# EAGLE design MainBoard_V1 (EAGLE 9.6.2)
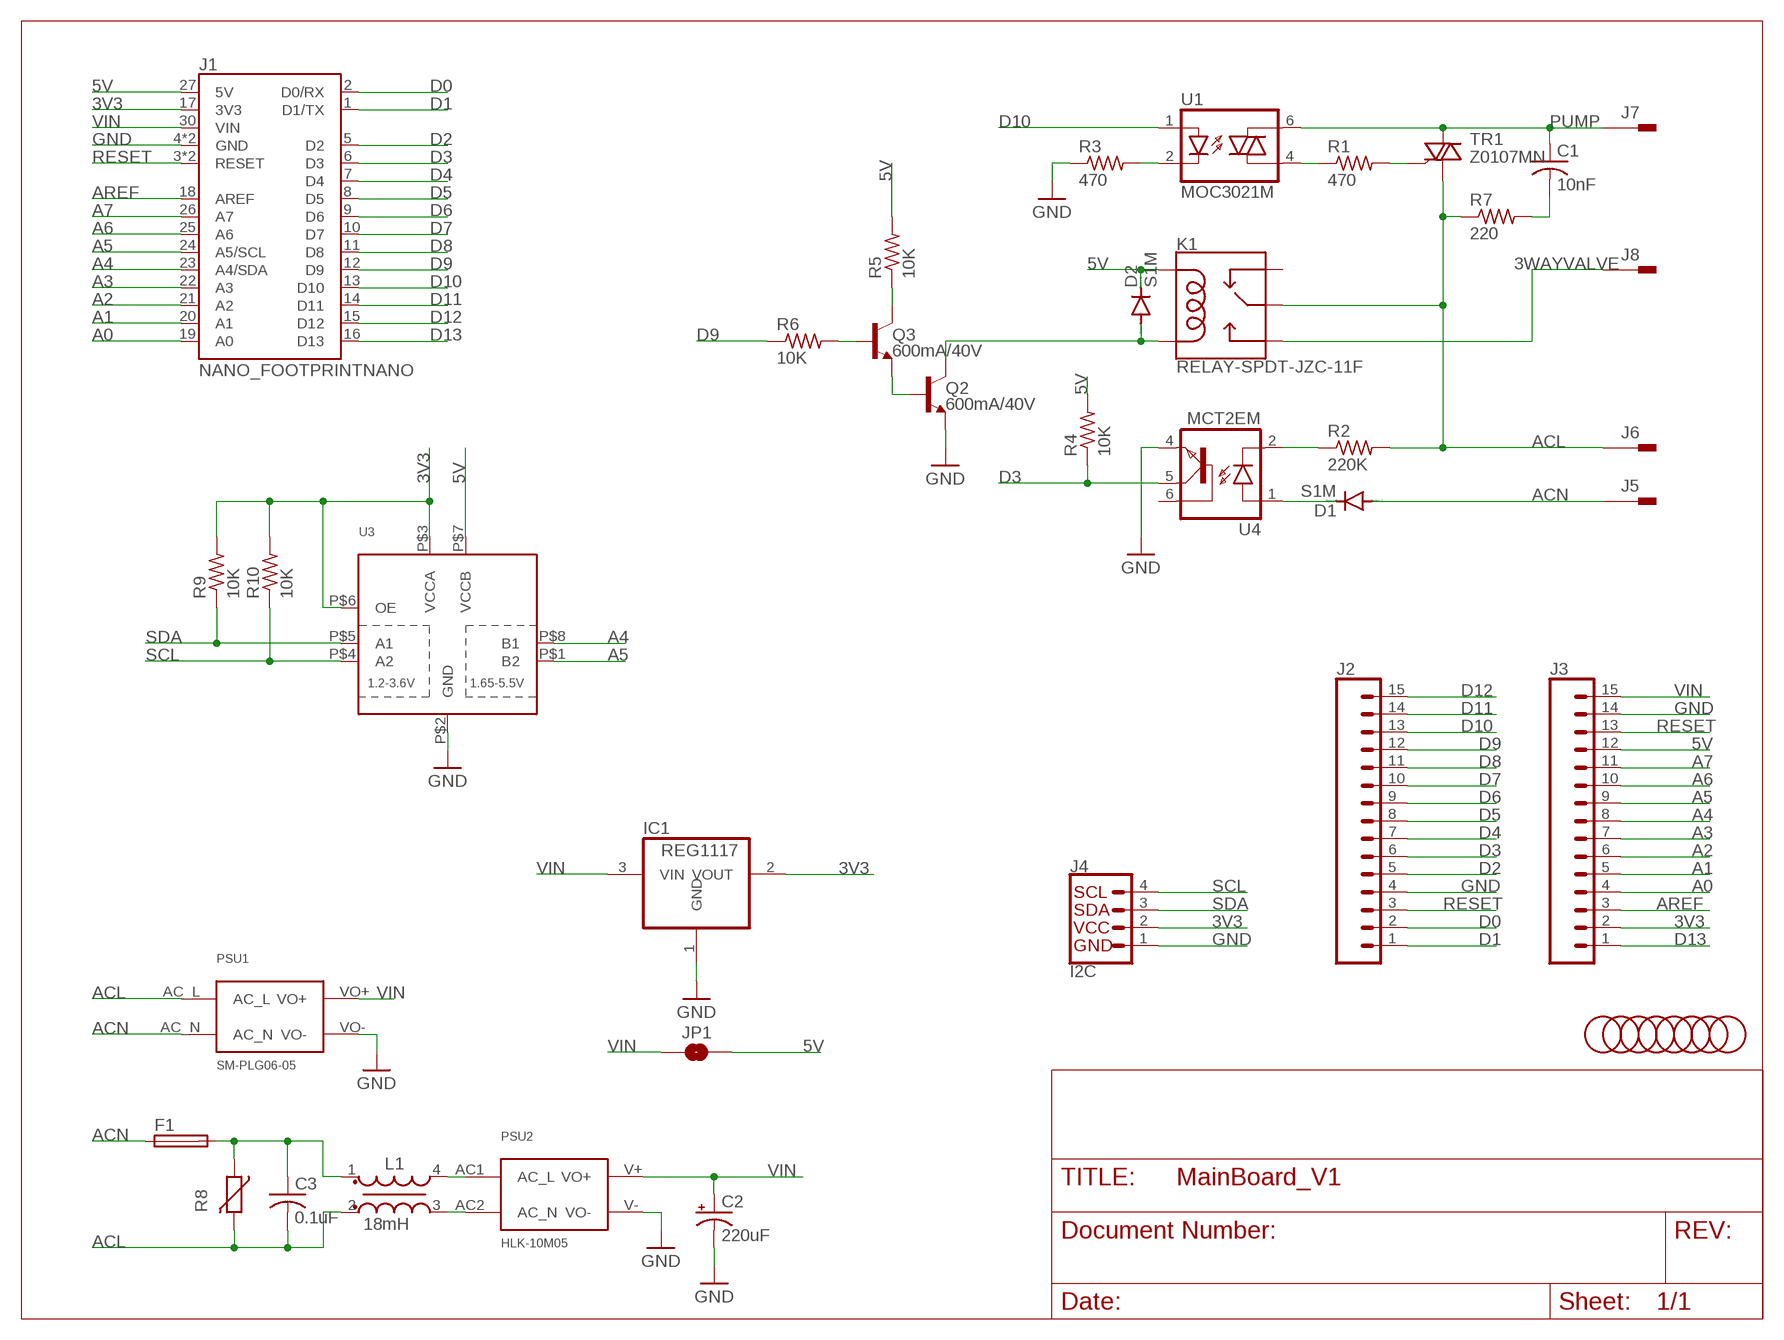
[diagram p0: schematic, sheet 1]

## Parts
C1  10nF  C-US075-032X103  [C075-032X103]
C2  220uF  CPOL-USE2.5-6  [E2,5-6]
C3  0.1uF  C-US150-054X183  [C150-054X183]
D1  S1M  [SMA]
D2  S1M  [SMA]
F1  FUSETE5  [TE5]
IC1  REG1117  [SOT223]
J1  NANO_FOOTPRINTNANO  [NANO]
J2  CONN_15  [1X15]
J3  CONN_15  [1X15]
J4  I2C  QWIIC_CONNECTOR  [JST04_1MM_VERT]
J5  PIN262409-1  [62409-1]
J6  PIN262409-1  [62409-1]
J7  PIN262409-1  [62409-1]
J8  PIN262409-1  [62409-1]
JP1  JUMPER-SMT_2_NO_SILK  [SMT-JUMPER_2_NO_SILK]
K1  RELAY-SPDT-JZC-11F  [RELAY-JZC]
L1  18mH  WE-TFC_UU9.8V_744862180  [WE-TFC_UU9.8V]
PSU1  SM-PLG06-05  [SM-PLG06]
PSU2  HLK-10M05  [HLK-10MXX]
Q2  600mA/40V  TRANS_NPN-MMBT2222AL  [SOT23-3]
Q3  600mA/40V  TRANS_NPN-MMBT2222AL  [SOT23-3]
R1  470  R-US_R0603  [R0603]
R2  220K  R-US_R0603  [R0603]
R3  470  R-US_R0603  [R0603]
R4  10K  R-US_R0603  [R0603]
R5  10K  R-US_R0603  [R0603]
R6  10K  R-US_R0603  [R0603]
R7  220  R-US_R2512  [R2512]
R8  VARISTOR-7,5  [R-7,5]
R9  10K  R-US_R0603  [R0603]
R10  10K  R-US_R0603  [R0603]
TR1  Z0107MN  Z0107MNSOT-223  [SOT223]
U1  MOC3021M  [DIL06]
U3  TXS0102  [VFSOP-8]
U4  MCT2EM  [PDIP6_8P89X6P60_ONS]
U$1  FIDUCIAL  [FIDUCIAL_1MM]
U$2  FIDUCIAL  [FIDUCIAL_1MM]
U$3  FIDUCIAL  [FIDUCIAL_1MM]
U$4  FIDUCIAL  [FIDUCIAL_1MM]
U$5  FIDUCIAL  [FIDUCIAL_1MM]
U$6  FIDUCIAL  [FIDUCIAL_1MM]
U$7  FIDUCIAL  [FIDUCIAL_1MM]
U$8  FIDUCIAL  [FIDUCIAL_1MM]

## Nets
3V3: IC1.2(VOUT) J1.17(3V3) J3.2 J4.2 R9.2 R10.2 U3.P$3(VCCA) U3.P$6(OE)
3WAYVALVE: J8.A1 J8.A2 K1.3(NO)
5V: D2.C J1.27(5V) J3.12 JP1.2 K1.5(COIL1) R4.2 R5.2 U3.P$7(VCCB)
A0: J1.19(A0) J3.4
A1: J1.20(A1) J3.5
A2: J1.21(A2) J3.6
A3: J1.22(A3) J3.7
A4: J1.23(A4/SDA) J3.8 U3.P$8(B1)
A5: J1.24(A5/SCL) J3.9 U3.P$1(B2)
A6: J1.25(A6) J3.10
A7: J1.26(A7) J3.11
ACL: C3.2 J6.A1 J6.A2 K1.4(MAIN) L1.2 PSU1.AC_L R2.2 R7.1 R8.2 TR1.1(A1)
ACN: D1.A F1.1 J5.A1 J5.A2 PSU1.AC_N
ACN1: C3.1 F1.2 L1.1 R8.1
AREF: J1.18(AREF) J3.3
D0: J1.2(D0/RX) J2.2
D1: J1.1(D1/TX) J2.1
D2: J1.5(D2) J2.5
D3: J1.6(D3) J2.6 R4.1 U4.5(COL)
D4: J1.7(D4) J2.7
D5: J1.8(D5) J2.8
D6: J1.9(D6) J2.9
D7: J1.10(D7) J2.10
D8: J1.11(D8) J2.11
D9: J1.12(D9) J2.12 R6.1
D10: J1.13(D10) J2.13 U1.1(A)
D11: J1.14(D11) J2.14
D12: J1.15(D12) J2.15
D13: J1.16(D13) J3.1
GND: C2.- IC1.1(GND) J1.4(GND) J1.29(GND) J2.4 J3.14 J4.1 PSU1.VO- PSU2.V-(VO-) Q2.2(E) R3.1 U3.P$2(GND) U4.4(EMI)
N$1: R1.1 U1.4(A1)
N$2: R1.2 TR1.3(G)
N$3: R3.2 U1.2(C)
N$4: C1.2 R7.2
N$5: R2.1 U4.2(C)
N$6: D1.C U4.1(A)
N$7: L1.4 PSU2.AC1(AC_L)
N$8: Q2.1(B) Q3.2(E)
N$9: D2.A K1.1(COIL2) Q2.3(C)
N$10: Q3.3(C) R5.1
N$11: Q3.1(B) R6.2
N$12: L1.3 PSU2.AC2(AC_N)
PUMP: C1.1 J7.A1 J7.A2 TR1.2(A2) TR1.4(A2) U1.6(A2)
RESET: J1.3(RESET) J1.28(RESET) J2.3 J3.13
SCL: J4.4 R10.1 U3.P$4(A2)
SDA: J4.3 R9.1 U3.P$5(A1)
VIN: C2.+ IC1.3(VIN) J1.30(VIN) J3.15 JP1.1 PSU1.VO+ PSU2.V+(VO+)
Unconnected: K1.2(NC) U4.6(BAS)

## Library data of the parts
C1 = rcl:C-US: CAPACITOR, American symbol; LCSC: C2893639; SPICEPREFIX: C
C2 = rcl:CPOL-US: POLARIZED CAPACITOR, American symbol; SPICEPREFIX: C
C3 = rcl:C-US: CAPACITOR, American symbol; SPICEPREFIX: C
D1 D2 = diode:S1M; LCSC: C155378
F1 = fuse:FUSE: Fuse; OC_FARNELL: unknown; OC_NEWARK: unknown
IC1 = burr-brown:REG1117: 800mA and 1A Low Dropout (LDO) Positive Regulator 1.8V, 2.5V, 2.85V, 3.3V, 5V, and Adj; LCSC: C26537; MPN: REG1117; OC_FARNELL: 1097566; OC_NEWARK: 14P6981
J1 = SparkFun-Boards:NANO_FOOTPRINT: Generic Nano Footprint
J2 J3 = SparkFun-Connectors:CONN_15: Multi connection point. Often used as Generic Header-pin footprint for 0.1 inch spaced/style header connections On any of the 0.1 inch spaced packages, you can populate with these: Break Away Headers - Straight <https://www.sparkfun.com/products/116> (PRT-00116) Break Away Male Headers - Right Angle <https://www.sparkfun.com/products/553> (PRT-00553) Female Headers <https://www.sparkfun.com/products/115> (PRT-00115) Break Away Headers - Machine Pin <https://www.sparkfun.com/products/117> (PRT-00117) Break Away Female Headers - Swiss Machine Pin <https://www.sparkfun.com/products/743> (PRT-00743) For SCREWTERMINALS and SPRING TERMINALS visit here: Screw Terimnals on SparkFun.com <https://www.sparkfun.com/search/results?term=Screw+Terminals> (5mm/3.5mm/2.54mm spacing) This device is also useful as a general connection point to wire up your design to another part of your project. Our various solder wires solder well into these plated through hole pads. Hook-Up Wire - Assortment (Stranded, 22 AWG) <https://www.sparkfun.com/products/11375> (PRT-11375) Hook-Up Wire - Assortment (Solid Core, 22 AWG) <https://www.sparkfun.com/products/11367> (PRT-11367) View the entire wire category on our website here <https://www.sparkfun.com/categories/141> Special notes: Molex polarized connector foot print use with SKU : PRT-08231 with associated crimp pins and housings. 1MM SMD Version SKU: PRT-10208 NOTES ON THE VARIANTS LOCK and LOCK_LONGPADS... This footprint was designed to help hold the alignment of a through-hole component (i.e. 6-pin header) while soldering it into place. You may notice that each hole has been shifted either up or down by 0.005 of an inch from it's more standard position (which is a perfectly straight line). This slight alteration caused the pins (the squares in the middle) to touch the edges of the holes. Because they are alternating, it causes a "brace" to hold the component in place. 0.005 has proven to be the perfect amount of "off-center" position when using our standard breakaway headers. Although looks a little odd when you look at the bare footprint, once you have a header in there, the alteration is very hard to notice. Also,if you push a header all the way into place, it is covered up entirely on the bottom side.; LCSC: C2894938
J4 = SparkFun-Connectors:QWIIC_CONNECTOR: SparkFun I2C Standard Qwiic Connector An SMD 1mm pitch JST connector makes it easy and quick (get it? Qwiic?) to connect I2C devices to each other. The Qwiic system <http://www.sparkfun.com/qwiic> enables fast and solderless connection between popular platforms and various sensors and actuators. We carry 200mm <https://www.sparkfun.com/products/14204>, 100mm <https://www.sparkfun.com/products/14205>, 50mm <https://www.sparkfun.com/products/14206>, and breadboard friendly <https://www.sparkfun.com/products/14207> Qwiic cables. We also offer 10 pcs strips <https://www.sparkfun.com/products/14323> the SMD connectors.; LCSC: C160390; PROD_ID: CONN-14483; VALUE: Vertical Qwiic Connector
J5-J8 = con-faston:PIN2: Flachstecker Typ Tyco/Electronics/AMP TAB, FASTON Printed Circuit Board Tabs Source: http://www.buerklin.com, http://catalog.tycoelectronics.com; LCSC: C305817; OC_FARNELL: unknown; OC_NEWARK: unknown
JP1 = SparkFun-Jumpers:JUMPER-SMT_2_NO: Normally open jumper This jumper has two pads in close proximity to each other. Apply solder to close the connection. Round pads are easier to solder for beginners, but are a lot larger. SparkFun Product that uses the round pads: SparkFun EL Sequencer <https://www.sparkfun.com/products/12781>
K1 = SparkFun-Electromechanical:RELAY-SPDT: SPDT Electromechanical Relay Single-pole, double-throw sealed relays. When current is applied to the coil, it throws a simple changeover switch, terminating the connection from the NC contact to ground and closing the NO contact. Use them to switch high voltage/high current devices. SparkFun Products JQX-15F: Relay SPDT Sealed - 20A <https://www.sparkfun.com/products/10924> (COM-10924) JZC-11F: Relay SPDT Sealed <https://www.sparkfun.com/products/100> (COM-00100); LCSC: C74541; PROD_ID: COMP-09533; SF_SKU: COM-00100
L1 = Wurth_EMC Components_WE-TFC:WE-TFC_UU9.8V: WE-TFC Common Mode Power Line Choke Characteristics Suppression of common mode noise up to 70 dB Approximate 1% stray inductance for symmetrical interference suppression High isolation between the windings Flammability corresponding to UL 94 V-0 Clima category 40/125/21 Applications Mains filter Compact switched-mode power supplies Electronic ballast applications (LED bulb) Lighting White goods <https://www.we-online.de/katalog/media/o182603v209%20Family_WE-TFC_UU9.8V_UU9.8H_744861xxx_744862xxx.jpg> Details see: https://www.we-online.de/katalog/en/WE-TFC Updated by Ella Wu 2021-02-04 2021 (C) Wurth Elektronik; DATASHEET-URL: https://www.we-online.com/catalog/datasheet/744862180.pdf; IR: 0.3A; MOUNT: THT; PART-NUMBER: 744862180; RDC: 3.1Ohm; VR: 300 V (AC); VT: 2500 V (AC)
PSU1 = discrete:SM-PLG06-05: AC-DC 5V Isolated Switching Power Supply Module
PSU2 = discrete:HLK-10M05: HLK-10M05 10W power 5V output AC-DC power module
Q2 Q3 = SparkFun-DiscreteSemi:TRANS_NPN: NPN transistor Current controlled devices typically used to amplify current or used as a switch. BC547 - COM-08928 <http://www.sparkfun.com/products/8928> (TO-92 45V 100mA) (1.Collector 2.Base 3.Emitter) 2N3904 - COM-00521 <http://www.sparkfun.com/products/521> (TO-92 40V 200mA) (1.Emitter 2.Base 3.Collector) P2N2222A - COM-12852 <http://www.sparkfun.com/products/12852> (TO-92 40V 600mA) (1.Collector 2.Base 3.Emitter); LCSC: C82460; PROD_ID: TRANS-08049
R1 R3 = rcl:R-US_: RESISTOR, American symbol; LCSC: C23179; SPICEPREFIX: R
R2 = rcl:R-US_: RESISTOR, American symbol; LCSC: C22961; SPICEPREFIX: R
R4-R6 R9 R10 = rcl:R-US_: RESISTOR, American symbol; LCSC: C98220; SPICEPREFIX: R
R7 = rcl:R-US_: RESISTOR, American symbol; LCSC: C38808; SPICEPREFIX: R
R8 = varistor:VARISTOR: VARISTOR
TR1 = discrete:Z0107MN: Triacs 1.0 Amp 600 Volt; LCSC: C145130
U1 = discrete:MOC3021M: RANDOM-PHASE OPTOISOLATORS TRIAC DRIVER OUTPUT; LCSC: C123202
U3 = adafruit:TXS0102: 2-Bit Bi-Directional Level Shifter (I2C, etc.) Designed for I2C devices and has internal pullups. Not to be confused with TXB010x series. 1.2V-3.6V (VCCA) to 1.65V-5.5V (VCCB) bi-directional level shifter with auto direction sensing. Max data rate - 24Mbps (Push Pull), 2Mbps (Open Drain) Digikey: 296-21931-1-ND; LCSC: C2677417
U4 = MCT2EM_Sym:MCT2EM; COPYRIGHT: Copyright (C) 2021 Ultra Librarian. All rights reserved.; LCSC: C258259; MANUFACTURER_PART_NUMBER: MCT2EM; MFR_NAME: ON Semiconductor
U$1-U$8 = adafruit:FIDUCIAL: For use by pick and place machines to calibrate the vision/machine, 1mm By microbuilder.eu

## Board
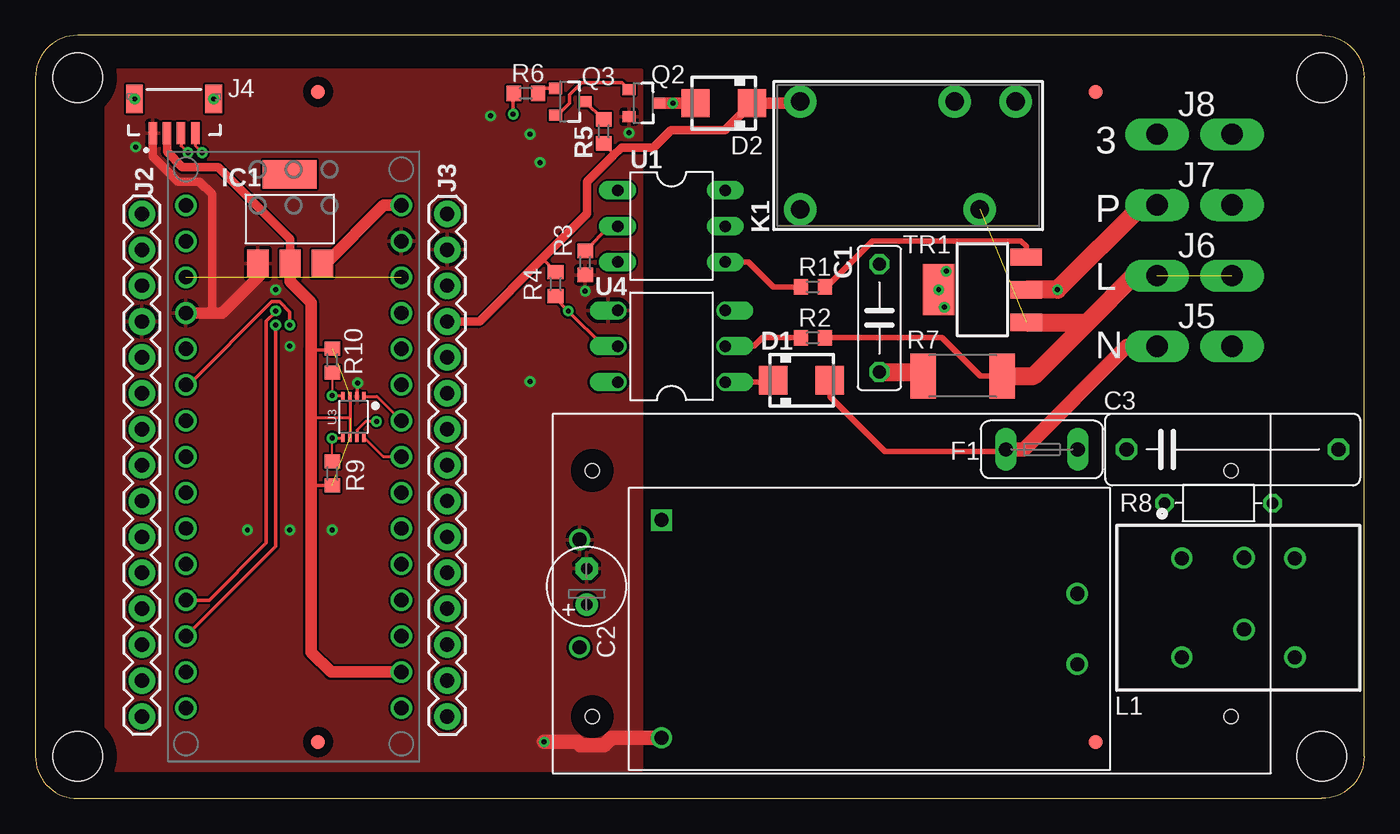
[diagram p1: board, top side]
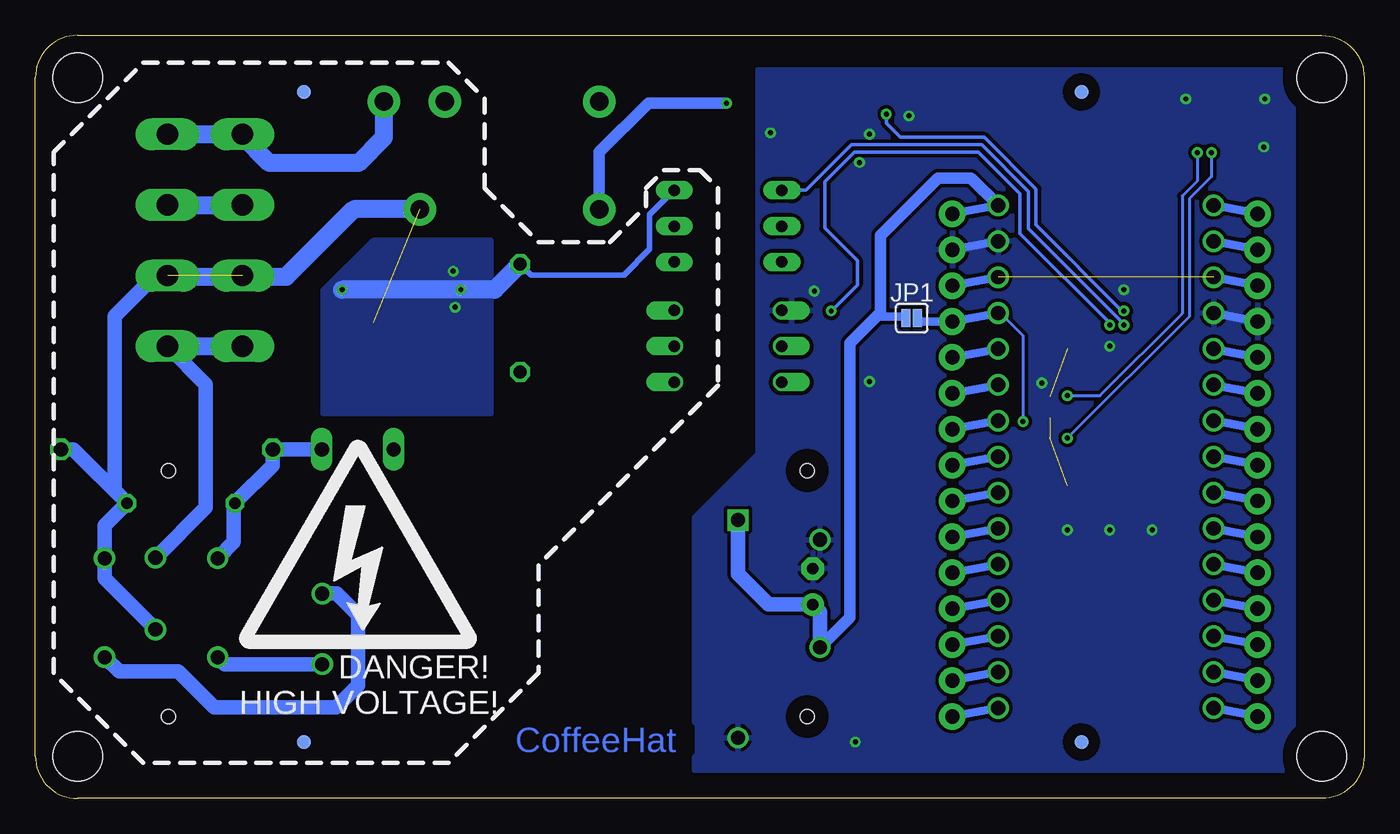
[diagram p2: board, bottom side, seen from below]

Size 94 x 54 mm. Coordinates in mm from the lower left corner, seen from the top.
Outline: 3,0 91,0 arc90 94,3 94,51 arc90 91,54 3,54 arc90 0,51 0,3 arc90 3,0
Copper layers (1*16): Top 0.035mm / dielectric 1.5mm / Bottom 0.035mm
Design rules "default": minimum track width 6mil, minimum drill 0.35mm, track to track 6mil, track to pad 6mil, pad to pad 6mil, via to via 6mil, smd to smd 6mil, copper to edge 40mil, drill to drill 6mil, minimum pad ring 10mil, minimum via ring 8mil, stop-mask expansion 4mil, vias tented up to drill 0mil, thermal gap 10mil
Holes 3.5 mm at 3,3 3,51 91,51 91,3

### Footprints (pad centres in the part's own frame; a part is rotated, then mirrored left to right if it is on the bottom)
C075-032X103 = drill 0.914 octagon: 1 -3.81,0; 2 3.81,0
E2,5-6 = drill 0.813 pad 1.6: + -1.27,0 | drill 0.813 pad 1.6 octagon: - 1.27,0
C150-054X183 = drill 1.016 octagon: 1 -7.493,0; 2 7.493,0
SMA = smd 2 x 2: A 2,0; C -2,0
TE5 = drill 1.016 long: 1 -2.54,0; 2 2.54,0
SOT223 = smd 1.499 x 2.007: 1 -2.261,-3.15; 2 0.025,-3.15; 3 2.311,-3.15 | smd 3.81 x 2.007: 4 0,3.15
NANO = drill 1.016: 1 -7.62,17.78; 2 -7.62,15.24; 3 -7.62,12.7; 4 -7.62,10.16; 5 -7.62,7.62; 6 -7.62,5.08; 7 -7.62,2.54; 8 -7.62,0; 9 -7.62,-2.54; 10 -7.62,-5.08; 11 -7.62,-7.62; 12 -7.62,-10.16; 13 -7.62,-12.7; 14 -7.62,-15.24; 15 -7.62,-17.78; 16 7.62,-17.78; 17 7.62,-15.24; 18 7.62,-12.7; 19 7.62,-10.16; 20 7.62,-7.62; 21 7.62,-5.08; 22 7.62,-2.54; 23 7.62,0; 24 7.62,2.54; 25 7.62,5.08; 26 7.62,7.62; 27 7.62,10.16; 28 7.62,12.7; 29 7.62,15.24; 30 7.62,17.78
1X15 = drill 1.016 pad 1.88: 1 0,0; 2 2.54,0; 3 5.08,0; 4 7.62,0; 5 10.16,0; 6 12.7,0; 7 15.24,0; 8 17.78,0; 9 20.32,0; 10 22.86,0; 11 25.4,0; 12 27.94,0; 13 30.48,0; 14 33.02,0; 15 35.56,0
JST04_1MM_VERT = smd 0.6 x 1.55: 1 -1.478,0.775; 2 -0.478,0.775; 3 0.522,0.775; 4 1.522,0.775 | smd 1.2 x 2: NC1 -2.778,3.2; NC2 2.822,3.2
62409-1 = drill 1.5 pad 1.9 long: A1 -2.65,0; A2 2.65,0
SMT-JUMPER_2_NO_SILK = smd 0.635 x 1.27: 1 -0.406,0; 2 0.406,0
RELAY-JZC = drill 1.3 pad 2.286: 1 3.81,-8.89; 2 -3.81,2.032; 3 -3.81,6.35; 4 3.81,3.81; 5 -3.81,-8.89
WE-TFC_UU9.8V = drill 1: 1 -4,3.5; 2 4,3.5; 3 4,-3.5; 4 -4,-3.5
SM-PLG06 = drill 1: AC_L -23.5,2.54; AC_N -23.5,-2.54; VO+ 23.5,3.81; VO- 23.5,-3.81 | hole 1: -22.6,8.7; -22.6,-8.7; 22.6,8.7; 22.6,-8.7
HLK-10MXX = drill 1: AC1 -14.7,2.5; AC2 -14.7,-2.5; V- 14.7,7.7 | drill 1 square: V+ 14.7,-7.7
SOT23-3 = smd 0.8 x 0.9: 1 -0.95,-1; 2 0.95,-1; 3 0,1.1
R0603 = smd 1 x 1.1: 1 -0.85,0; 2 0.85,0
R2512 = smd 1.8 x 3.2: 1 -2.8,0; 2 2.8,0
R-7,5 = drill 0.813 octagon: 1 -3.81,0; 2 3.81,0
SOT223' = smd 1.219 x 2.235: 1 -2.311,-3.099; 2 0,-3.099; 3 2.311,-3.099 | smd 3.6 x 2.2: 4 0,3.099
DIL06 = drill 0.813 long: 1 -2.54,-3.81; 2 0,-3.81; 3 2.54,-3.81; 4 2.54,3.81; 5 0,3.81; 6 -2.54,3.81
VFSOP-8 = smd 0.25 x 0.65: P$1 -0.75,-1.45; P$2 -0.25,-1.45; P$3 0.25,-1.45; P$4 0.75,-1.45; P$5 0.75,1.45; P$6 0.25,1.45; P$7 -0.25,1.45; P$8 -0.75,1.45
PDIP6_8P89X6P60_ONS = drill 0.813 offset: 1 -2.54,-3.81; 2 0,-3.81; 3 2.54,-3.81; 4 2.54,3.81; 5 0,3.81; 6 -2.54,3.81
FIDUCIAL_1MM = smd 1 x 1: 1 0,0

### Placement (x,y rotation side)
C1  59.7,34 270 top
C2  39,15 90 top
C3  84.7,24.7 0 top
D1  54.2,29.6 0 top
D2  48.7,49.2 180 top
F1  71.2,24.7 0 top
IC1  18,41 0 top
J1  18.27,24.19 0 top
J2  7.54,41.37 270 top
J3  29.13,5.81 90 top
J4  9.79,46.3 0 top
J5  82,32 0 top
J6  82,37 0 top
J7  82,42 0 top
J8  82,47 0 top
JP1  32,34 0 bottom
K1  63,45.5 270 top
L1  85.1,13.5 0 top
PSU1  62,14.5 180 top
PSU2  59,12 180 top
Q2  43,49.2 270 top
Q3  37.8,49.3 270 top
R1  55,36.2 0 top
R2  55,32.6 0 top
R3  38.9,37.9 90 top
R4  36.8,36.4 90 top
R5  40.2,47.2 270 top
R6  34.7,49.9 0 top
R7  65.6,29.9 180 top
R8  83.7,20.9 0 top
R9  21,23 270 top
R10  21,31 90 top
TR1  Z0107MN  [SOT223']  67,36 90 top
U1  45,40.5 270 top
U3  22.5,27 180 top
U4  45,32 90 top
U$1  20,50 0 top
U$2  20,4 0 top
U$3  20,50 0 bottom
U$4  20,4 0 bottom
U$5  75,50 0 top
U$6  75,50 0 bottom
U$7  75,4 0 bottom
U$8  75,4 0 top
U$9  [HV_LOGO_3]  80.01,10.67 0 bottom

### Tracks (layer width: path | path; a pad name or v marks a point on that pad's centre or on a via)
3V3  (3 unrouted)
  Top 0.203: 22.25,26.92 19.5,26.92 | U3.P$3 U3.P$6
  Top 0.254: R10.2 20.9,31.75 19.5,31.75 | R9.2 19.55,22.15
  Top 0.61: J4.2 9.31,45.76 10.4,44.67 12.94,44.67 18.02,39.58 IC1.2
  Top 0.813: IC1.2 18.02,36.58 19.5,35.1 19.5,31.75 19.5,10.36 20.91,8.95 J1.17
  Bottom 0.61: J3.2 J1.17
3WAYVALVE
  Bottom 1.27: K1.3 69.35,46.76 71.14,44.97 77.45,44.97 79.35,46.87 | 79.35,46.87 J8.A1 | J8.A2 79.48,47 79.35,46.87
5V  (via drill 0.35)
  Top 0.203: v24.13,26.67 23.36,26.67 22.75,26.06 U3.P$7
  Top 0.254: R4.2 35.86,38.19 35.85,38.19 | R5.2 40.87,45.68 40.87,45.49
  Top 0.61: J3.12 31.42,33.75 35.85,38.19 39.04,41.37 39.04,43.66 40.87,45.49 41.45,46.07 43.73,46.07 44.96,47.3 48.8,47.3 D2.C
  Top 0.813: D2.C 54,49.2 K1.5
  Bottom 0.203: J1.27 25.72,34.35 24.13,32.76 v24.13,26.67
  Bottom 0.61: J1.27 J3.12 31.34,33.75 JP1.2
A0
  Bottom 0.61: J3.4 J1.19
A1
  Bottom 0.61: J3.5 J1.20
A2
  Bottom 0.61: J3.6 J1.21
A3
  Bottom 0.61: J3.7 J1.22
A4
  Top 0.203: U3.P$8 24.61,24.19 J1.23
  Bottom 0.61: J3.8 J1.23
A5
  Top 0.203: U3.P$1 24.17,28.45 J1.24
  Bottom 0.61: J3.9 J1.24
A6
  Bottom 0.61: J3.10 J1.25
A7
  Bottom 0.61: J3.11 J1.26
ACL  (2 unrouted)
  Top 0.406: R7.1 66.85,29.9 64.14,32.61 56.06,32.61 R2.2
  Top 1.27: TR1.1 74.41,33.69 | 74.41,33.69 77.72,37 77.73,37 J6.A1 | R7.1 70.62,29.9 74.41,33.69
  Bottom 1.016: R8.2 88.4,21.79 88.4,34.13 85.61,36.92 84.44,36.92 | C3.2 91.31,24.7 R8.2 | R8.2 89.1,19.31 L1.2 89.1,15.56 PSU1.AC_L
  Bottom 1.27: 84.44,36.92 76.25,36.92 71.48,41.69 K1.4
ACN
  Top 0.406: D1.A 56.2,28.46 60.09,24.57 68.53,24.57
  Top 1.016: 68.53,24.57 F1.1 69.93,24.7 77.23,32 J5.A1
  Bottom 1.016: PSU1.AC_N 81.94,20.6 81.94,29.29 J5.A2
  Bottom 1.27: J5.A2 J5.A1
ACN1
  Bottom 1.016: F1.2 C3.1 77.22,24.68 77.22,23.57 R8.1 79.96,20.83 79.96,18.14 L1.1
AREF
  Bottom 0.61: J3.3 J1.18
D0
  Bottom 0.61: J2.2 J1.2
D1
  Bottom 0.61: J2.1 J1.1
D2
  Bottom 0.61: J2.5 J1.5
D3  (via drill 0.35)
  Top 0.254: J1.6 10.84,29.27 16.73,35.16 17.27,35.16 18,34.43 v18,33.5 | R4.1 36.8,35.4 v37.7,34.5 40.2,32 U4.5
  Bottom 0.254: v18,33.5 18,33.63 24.34,39.97 24.34,42.78 27.3,45.74 36.06,45.74 38.15,43.66 38.15,40.35 35.86,38.07 35.86,36.34 v37.7,34.5
  Bottom 0.61: J2.6 J1.6
D4
  Bottom 0.61: J2.7 J1.7
D5
  Bottom 0.61: J2.8 J1.8
D6
  Bottom 0.61: J2.9 J1.9
D7
  Bottom 0.61: J2.10 J1.10
D8
  Bottom 0.61: J2.11 J1.11
D9  (via drill 0.35)
  Top 0.254: v17,34.5 17,34.43 16.34,33.77 16.34,18.07 12.3,14.03 J1.12 | v33.81,48.42 33.81,49.86 R6.1
  Bottom 0.254: v17,34.5 17.13,34.5 23.22,40.59 23.22,43.13 26.88,46.78 32.79,46.78 33.81,47.8 v33.81,48.42
  Bottom 0.61: J2.12 J1.12
D10  (via drill 0.35)
  Top 0.254: v17,33.5 17,17.84 J1.13
  Bottom 0.254: U1.1 39.48,43.04 36.27,46.25 27.04,46.25 23.75,42.96 23.75,40.32 17,33.57 v17,33.5
  Bottom 0.61: J2.13 J1.13
D11
  Bottom 0.61: J2.14 J1.14
D12
  Bottom 0.61: J2.15 J1.15
D13
  Bottom 0.61: J3.1 J1.16
GND  (via drill 0.35)
  Top 0.203: v22.8,29.4 22.75,29.35 U3.P$2
  Top 0.61: J4.1 8.31,45.42 10.08,43.66 11.6,43.66 12.49,42.77 12.49,34.35
  Top 0.813: J1.4 12.49,34.35 13.22,34.35 15.95,37.08 IC1.1
  Top 1.016: PSU2.V- 40.76,4.3 40.24,3.78 38.56,3.78 38.34,4 v36,4
  Bottom 0.61: J2.4 J1.4 10.86,34.35 | J3.14 J1.29
  other vias: 7.03,49.5 12.62,49.5 35,29.5 21,19 18,19 15,19 17,36 7.1,46.1 35.7,45 32.2,48.3 18,32 35,47 42,47.1 38.9,35.9
  pour Bottom (isolate 0.254): 5,51.53 42.88,51.53 42.88,24.35 47.37,19.86 47.37,2 5,2
  pour Top: 5,51.53 42.88,51.53 42.88,2 5,2
N$1
  Top 0.406: R1.1 52.21,36.2 50.45,37.96 U1.4
N$2
  Top 0.406: TR1.3 70.1,39.07 69.72,39.45 59.23,39.45 55.98,36.2 R1.2
N$3
  Top 0.254: R3.2 40.62,40.5 U1.2
N$4
  Top 1.27: C1.2 59.74,30.15 62.55,30.15 R7.2
N$5
  Top 0.406: R2.1 51.44,32.6 50.84,32 U4.2
N$6
  Top 0.406: D1.C 52.06,29.46 U4.1
N$7
  Bottom 1.016: L1.4 80.6,9.5 PSU2.AC1
N$8
  Top 0.254: Q3.2 36.93,48.35 37.79,49.21 37.79,49.82 38.63,50.66 41.49,50.66 Q2.1
N$9  (via drill 0.35)
  Top 0.813: Q2.3 v45.1,49.2 D2.A
  Bottom 0.813: K1.1 54.11,45.73 50.64,49.2 v45.1,49.2
N$10
  Top 0.254: R5.1 40.15,48.05 Q3.3
N$11
  Top 0.254: Q3.1 35.9,50.25 R6.2
N$12
  Bottom 1.016: L1.3 88.08,8.98 83.89,8.98 81.35,6.44 72.74,6.44 71.16,8.02 71.16,12.98 72.68,14.5 PSU2.AC2
PUMP  (via drill 0.35)
  Top 0.406: v64.44,37.31 64.44,36.53 TR1.4 64.31,35.59 v64.31,34.77
  Top 1.27: TR1.2 v72.31,36 78.31,42 J7.A1
  Bottom 0.406: U1.6 50.55,41.3 50.55,38.86 52.36,37.05 58.94,37.05 C1.1
  Bottom 1.27: C1.1 61.51,36 v72.31,36 | J7.A2 J7.A1
  other vias: 63.9,36
  pour Bottom (isolate 0.254): 61.75,39.49 70.08,39.49 73.64,35.92 73.64,27.23 61.75,27.23
RESET  (1 unrouted)
  Bottom 0.61: J2.3 J1.3 | J3.13 J1.28
SCL  (via drill 0.35)
  Top 0.152: R10.1 v21,28.5
  Top 0.203: J4.4 11.31,46.19 v11.8,45.7 | v21,28.5 21.7,28.5 U3.P$4
  Bottom 0.203: v21,28.5 18.68,28.5 12.87,34.31 12.87,42.63 11.8,43.7 v11.8,45.7
SDA  (via drill 0.35)
  Top 0.152: R9.1 v21,25.5
  Top 0.203: J4.3 10.31,46.19 v10.8,45.7 | v21,25.5 21.75,25.5 U3.P$5
  Bottom 0.203: v10.8,45.7 10.8,44 12.37,42.43 12.37,34.12 20.98,25.5 v21,25.5
VIN
  Top 0.813: IC1.3 20.52,37.84 24.65,41.97 J1.30
  Bottom 0.61: J3.15 J1.30 | JP1.1 32.5,34.09 34.5,34.09
  Bottom 0.813: PSU1.VO+ 36.38,12.81 36.38,32.21 34.5,34.09 34.21,34.38 34.21,39.85 30.15,43.91 27.83,43.91 J1.30
  Bottom 1.016: PSU1.VO+ 38.49,13.22 C2.+ 42.14,13.73 44.3,15.89 PSU2.V+

### Text on the board
Bottom: CoffeeHat
bPlace: DANGER! / HIGH VOLTAGE!
tNames: 3 / P / L / N